# Altium project ePBR25_ACU_Controller.PrjPCB (part 2 of 2)
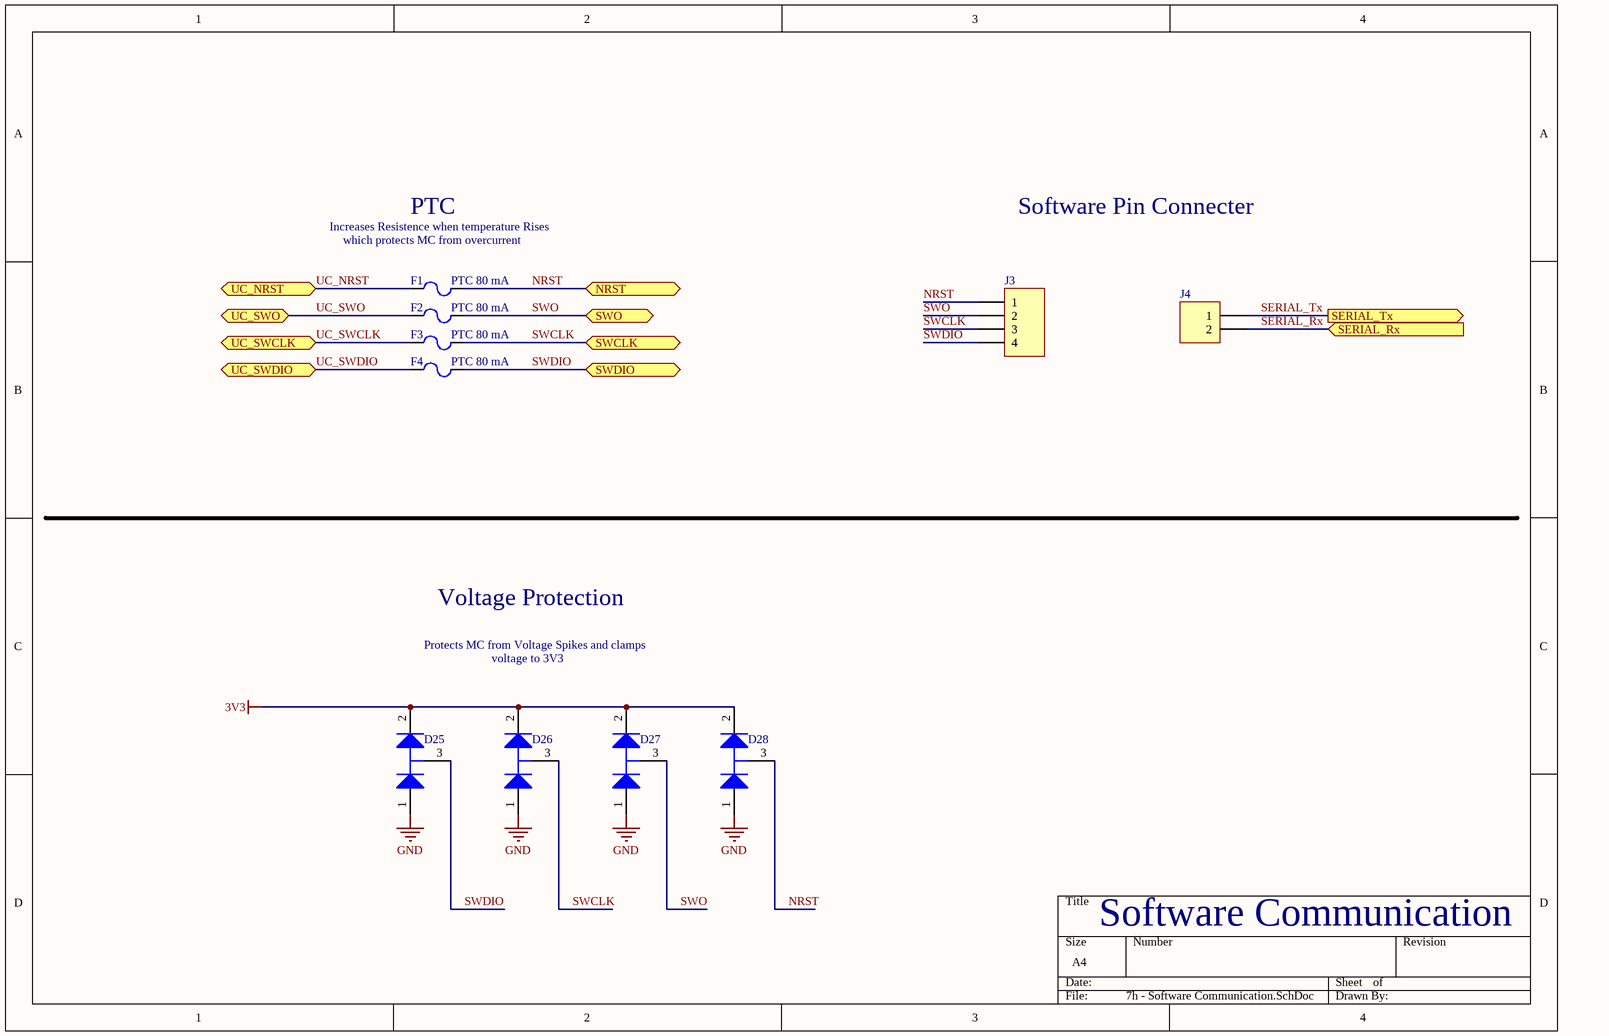
[diagram p9: 7h - Software Communication.SchDoc]

## Nets that join several sheets
3V3: 7  - Microcontroller (7 pins), 7a - Controller (13 pins), 7b - High Current Path Detection (D4.2 D5.2), 7c - FET Controls (D6.2), 7d - Sensors (5 pins), 7e - VBATT Stepdown (5 pins), 7f - CAN (C30.2 C31.2 U2.3 U3.3), 7g - Current FB Protection (6 pins), 7h - Software Communication (D25.2 D26.2 D27.2 D28.2)
ACU_PWR: 7  - Microcontroller (ACU_PWR.1 ACU_PWR.2 J1.A7 J2.A8), 7a - Controller (C2.2 Ref1.4), 7c - FET Controls (R20.2), 7e - VBATT Stepdown (R41.1)
GND: 7  - Microcontroller (17 pins), 7a - Controller (32 pins), 7b - High Current Path Detection (6 pins), 7c - FET Controls (11 pins), 7d - Sensors (13 pins), 7e - VBATT Stepdown (15 pins), 7f - CAN (6 pins), 7g - Current FB Protection (18 pins), 7h - Software Communication (D25.1 D26.1 D27.1 D28.1)
AIR+_CTRL: 7  - Microcontroller (J1.B9), 7c - FET Controls (Q2.3)
AIR+_CTRL_µC: 7a - Controller (U1.57), 7c - FET Controls (R15.1)
AIR+_FB: 7  - Microcontroller (J1.B5), 7g - Current FB Protection (R50.1)
AIR+_FB_µC: 7a - Controller (U1.54), 7g - Current FB Protection (C35.2 D22.3 R50.2 R57.2)
AIR-_CTRL: 7  - Microcontroller (J1.B8), 7c - FET Controls (Q1.3)
AIR-_CTRL_µC: 7a - Controller (U1.56), 7c - FET Controls (R14.1)
AIR-_FB: 7  - Microcontroller (J1.B4), 7g - Current FB Protection (R55.1)
AIR-_FB_µC: 7a - Controller (U1.53), 7g - Current FB Protection (C33.2 D20.3 R52.2 R55.2)
AMS_CLR_ERR: 7  - Microcontroller (J1.A8), 7c - FET Controls (Q4.3 R20.1)
AMS_CLR_ERR_µC: 7a - Controller (U1.55), 7c - FET Controls (R21.1)
AMS_OK: 7  - Microcontroller (J1.B11), 7e - VBATT Stepdown (R37.1)
AMS_OK_µC: 7a - Controller (U1.52), 7e - VBATT Stepdown (C27.2 D14.3 R37.2 R38.2)
BRAKE_PRESS: 7  - Microcontroller (J1.A10), 7d - Sensors (R25.2)
BRAKE_PRESS_µC: 7a - Controller (U1.84), 7d - Sensors (C20.2 D7.3 R25.1 R26.2)
BSPD_OK: 7  - Microcontroller (J1.B13), 7e - VBATT Stepdown (R39.1)
BSPD_OK_µC: 7a - Controller (U1.29), 7e - VBATT Stepdown (C28.2 D15.3 R39.2 R40.2)
BUZR_CTRL: 7  - Microcontroller (J1.A5), 7a - Controller (U1.70)
BUZR_FB: 7  - Microcontroller (J2.B5), 7g - Current FB Protection (R49.1 R51.2)
BUZR_FB_µC: 7a - Controller (U1.24), 7g - Current FB Protection (C32.2 D19.3 R49.2)
CAN_N: 7  - Microcontroller (J2.A13), 7f - CAN (D17.1 R44.1 U2.6)
CAN_P: 7  - Microcontroller (J2.A12), 7f - CAN (D17.2 R44.2 U2.7)
CAN_Rx: 7a - Controller (U1.81), 7f - CAN (R45.1)
CAN_SENS_N: 7  - Microcontroller (J2.B13), 7f - CAN (D18.1 R47.1 U3.6)
CAN_SENS_P: 7  - Microcontroller (J2.B12), 7f - CAN (D18.2 R47.2 U3.7)
CAN_SENS_Rx: 7a - Controller (U1.91), 7f - CAN (R48.1)
CAN_SENS_Tx: 7a - Controller (U1.92), 7f - CAN (R46.1)
CAN_Tx: 7a - Controller (U1.82), 7f - CAN (R43.1)
EXTRA_INPUT1: 7  - Microcontroller (J1.A1), 7d - Sensors (R28.2)
EXTRA_INPUT1_µC: 7a - Controller (U1.36), 7d - Sensors (C22.2 D9.3 R28.1 R29.2)
EXTRA_INPUT2: 7  - Microcontroller (J2.A10), 7d - Sensors (R31.2)
EXTRA_INPUT2_µC: 7a - Controller (U1.5), 7d - Sensors (C24.2 D11.3 R31.1 R32.2)
FANS_CTRL: 7  - Microcontroller (J1.B7), 7a - Controller (U1.43)
FANS_FB: 7  - Microcontroller (J2.B6), 7g - Current FB Protection (R54.1 R56.2)
FANS_FB_µC: 7a - Controller (U1.23), 7g - Current FB Protection (C34.2 D21.3 R54.2)
HCP_H_CURR_SENS: 7  - Microcontroller (J2.B1), 7b - High Current Path Detection (R12.2)
HCP_H_CURR_SENS_µC: 7a - Controller (U1.33), 7b - High Current Path Detection (C18.2 D5.3 R12.1 R13.2)
HCP_L_CURR_SENS: 7  - Microcontroller (J2.A2), 7b - High Current Path Detection (R10.2)
HCP_L_CURR_SENS_µC: 7a - Controller (U1.34), 7b - High Current Path Detection (C17.2 D4.3 R10.1 R11.2)
IMD__OK: 7  - Microcontroller (J1.B3), 7e - VBATT Stepdown (R33.1)
IMD__OK_µC: 7a - Controller (U1.51), 7e - VBATT Stepdown (C25.2 D12.3 R33.2 R35.2)
IMD_RESIST: 7  - Microcontroller (J2.B11), 7c - FET Controls (R23.1)
IMD_RESIST_µC: 7a - Controller (U1.93), 7c - FET Controls (C19.2 D6.3 R23.2 R24.2)
MC_PWR_CTRL: 7  - Microcontroller (J1.A2), 7a - Controller (U1.38)
MC_PWR_FB: 7  - Microcontroller (J2.A5), 7g - Current FB Protection (R59.1 R60.2)
MC_PWR_FB_µC: 7a - Controller (U1.31), 7g - Current FB Protection (C36.2 D23.3 R59.2)
NRST: 7  - Microcontroller (J1.B12), 7h - Software Communication (D28.3 F1.2 J3.1)
PRECHRG_CTRL: 7  - Microcontroller (J1.A9), 7c - FET Controls (Q3.3)
PRECHRG_CTRL_µC: 7a - Controller (U1.60), 7c - FET Controls (R18.1)
PUMP_CTRL: 7  - Microcontroller (J1.B6), 7a - Controller (U1.41)
PUMP_FB: 7  - Microcontroller (J2.A9), 7g - Current FB Protection (R61.1 R62.2)
PUMP_FB_µC: 7a - Controller (U1.18), 7g - Current FB Protection (C37.2 D24.3 R61.2)
PWR_MON_SCL: 7  - Microcontroller (J2.B3), 7d - Sensors (R30.1)
PWR_MON_SDA: 7  - Microcontroller (J2.B2), 7d - Sensors (R27.1)
SCHT_TAP: 7  - Microcontroller (J1.A6), 7e - VBATT Stepdown (R34.1)
SERIAL_Rx: 7  - Microcontroller (J2.A15), 7a - Controller (U1.87), 7h - Software Communication (J4.2)
SERIAL_Tx: 7  - Microcontroller (J2.A14), 7a - Controller (U1.86), 7h - Software Communication (J4.1)
SHCT_TAP_µC: 7a - Controller (U1.59), 7e - VBATT Stepdown (C26.2 D13.3 R34.2 R36.2)
SWCLK: 7  - Microcontroller (J1.A13), 7h - Software Communication (D26.3 F3.2 J3.3)
SWDIO: 7  - Microcontroller (J1.B14), 7h - Software Communication (D25.3 F4.2 J3.4)
SWO: 7  - Microcontroller (J1.A12), 7h - Software Communication (D27.3 F2.2 J3.2)
UC_NRST: 7a - Controller (C5.2 U1.14), 7h - Software Communication (F1.1)
uC_PWR_MON_SCL: 7a - Controller (U1.47), 7d - Sensors (C23.2 D10.3 R30.2)
uC_PWR_MON_SDA: 7a - Controller (U1.80), 7d - Sensors (C21.2 D8.3 R27.2)
UC_SWCLK: 7a - Controller (U1.76), 7h - Software Communication (F3.1)
UC_SWDIO: 7a - Controller (U1.72), 7h - Software Communication (F4.1)
UC_SWO: 7a - Controller (U1.89), 7h - Software Communication (F2.1)
vBATT_uC: 7a - Controller (U1.17), 7e - VBATT Stepdown (C29.2 D16.3 R41.2 R42.2)